# EAGLE design ESP8266-TFT-PCB (EAGLE 8.7.1)
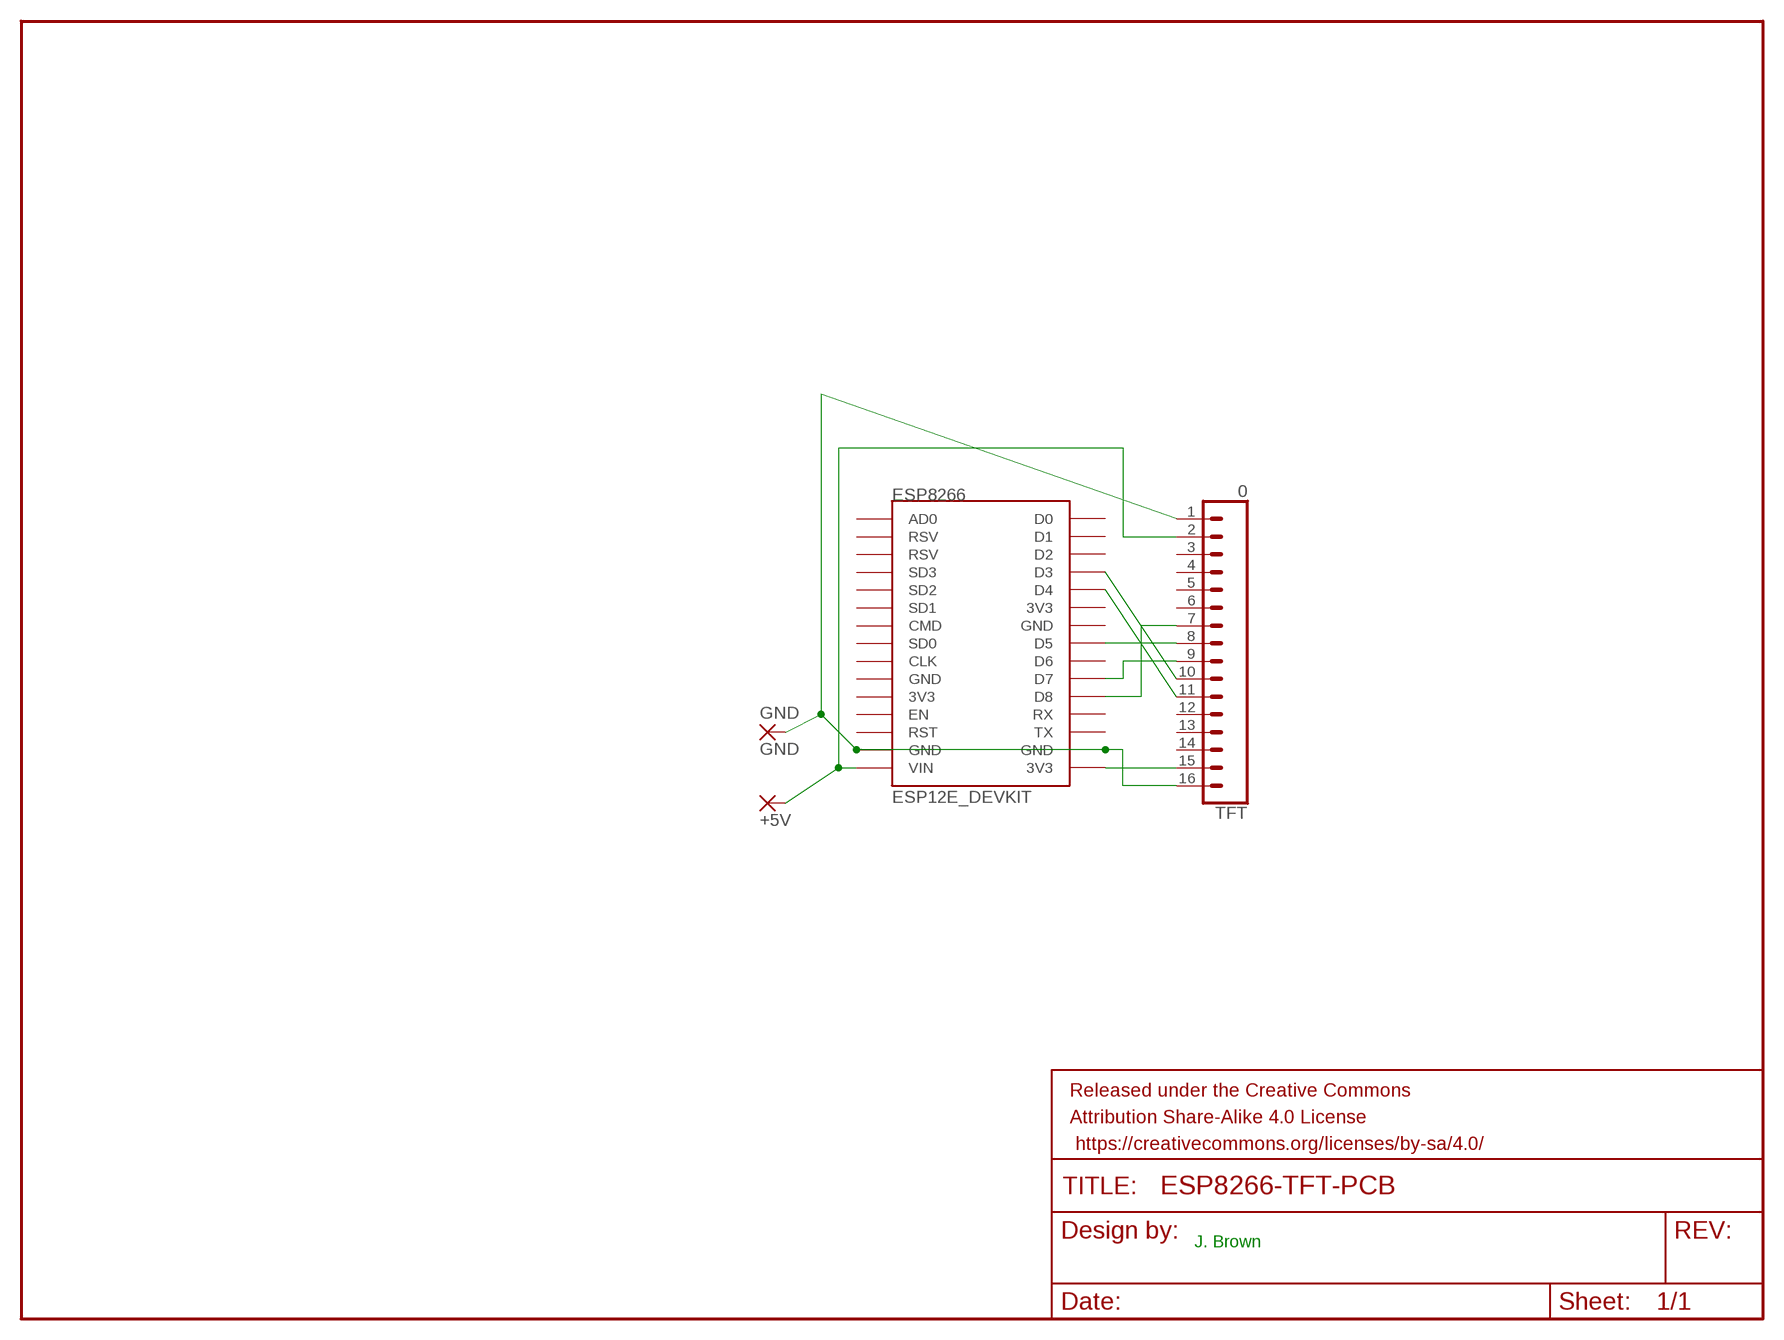
[diagram p0: schematic, sheet 1]

## Parts
ESP8266  ESP12E_DEVKIT  [ESP12E_DEVKIT]
FRAME1  FRAME-LETTER  [CREATIVE_COMMONS]
GND  GND  3,81/1,4  [3,81/1,4]
TFT  0  CONN_16  [1X16]
VCC  +5V  3,81/1,4  [3,81/1,4]

## Nets
GND: ESP8266.GND@1(GND) ESP8266.GND@3(GND) GND.1(P) TFT.1 TFT.16
N$1: ESP8266.3V3@2(3V3) TFT.15
N$5: ESP8266.D8 TFT.7
N$6: ESP8266.D5 TFT.8
N$7: ESP8266.D7 TFT.9
N$8: ESP8266.D4 TFT.11
N$9: ESP8266.D3 TFT.10
VCC: ESP8266.VIN TFT.2 VCC.1(P)
Unconnected: ESP8266.3V3@0(3V3) ESP8266.3V3@1(3V3) ESP8266.AD0 ESP8266.CLK ESP8266.CMD ESP8266.D0 ESP8266.D1 ESP8266.D2 ESP8266.D6 ESP8266.EN ESP8266.GND@0(GND) ESP8266.GND@2(GND) ESP8266.RST ESP8266.RSV@0(RSV) ESP8266.RSV@1(RSV) ESP8266.RX ESP8266.SD0 ESP8266.SD1 ESP8266.SD2 ESP8266.SD3 ESP8266.TX TFT.3 TFT.4 TFT.5 TFT.6 TFT.12 TFT.13 TFT.14

## Notes on the sheet
- J. Brown

## Library data of the parts
ESP8266 = ESP12E_DEVKIT:ESP12E_DEVKIT: ESP12E DEVKIT BOARD
FRAME1 = SparkFun-Aesthetics:FRAME-LETTER: Schematic Frame - Letter Standard 8.5x11 US Letter frame
GND VCC = wirepad:3,81/1,4: THROUGH-HOLE PAD
TFT = SparkFun-Connectors:CONN_16: Multi connection point. Often used as Generic Header-pin footprint for 0.1 inch spaced/style header connections On any of the 0.1 inch spaced packages, you can populate with these: Break Away Headers - Straight <https://www.sparkfun.com/products/116> (PRT-00116) Break Away Male Headers - Right Angle <https://www.sparkfun.com/products/553> (PRT-00553) Female Headers <https://www.sparkfun.com/products/115> (PRT-00115) Break Away Headers - Machine Pin <https://www.sparkfun.com/products/117> (PRT-00117) Break Away Female Headers - Swiss Machine Pin <https://www.sparkfun.com/products/743> (PRT-00743) For SCREWTERMINALS and SPRING TERMINALS visit here: Screw Terimnals on SparkFun.com <https://www.sparkfun.com/search/results?term=Screw+Terminals> (5mm/3.5mm/2.54mm spacing) This device is also useful as a general connection point to wire up your design to another part of your project. Our various solder wires solder well into these plated through hole pads. Hook-Up Wire - Assortment (Stranded, 22 AWG) <https://www.sparkfun.com/products/11375> (PRT-11375) Hook-Up Wire - Assortment (Solid Core, 22 AWG) <https://www.sparkfun.com/products/11367> (PRT-11367) View the entire wire category on our website here <https://www.sparkfun.com/categories/141> Special notes: Molex polarized connector foot print use with SKU : PRT-08231 with associated crimp pins and housings. 1MM SMD Version SKU: PRT-10208 NOTES ON THE VARIANTS LOCK and LOCK_LONGPADS... This footprint was designed to help hold the alignment of a through-hole component (i.e. 6-pin header) while soldering it into place. You may notice that each hole has been shifted either up or down by 0.005 of an inch from it's more standard position (which is a perfectly straight line). This slight alteration caused the pins (the squares in the middle) to touch the edges of the holes. Because they are alternating, it causes a "brace" to hold the component in place. 0.005 has proven to be the perfect amount of "off-center" position when using our standard breakaway headers. Although looks a little odd when you look at the bare footprint, once you have a header in there, the alteration is very hard to notice. Also,if you push a header all the way into place, it is covered up entirely on the bottom side.

## Board
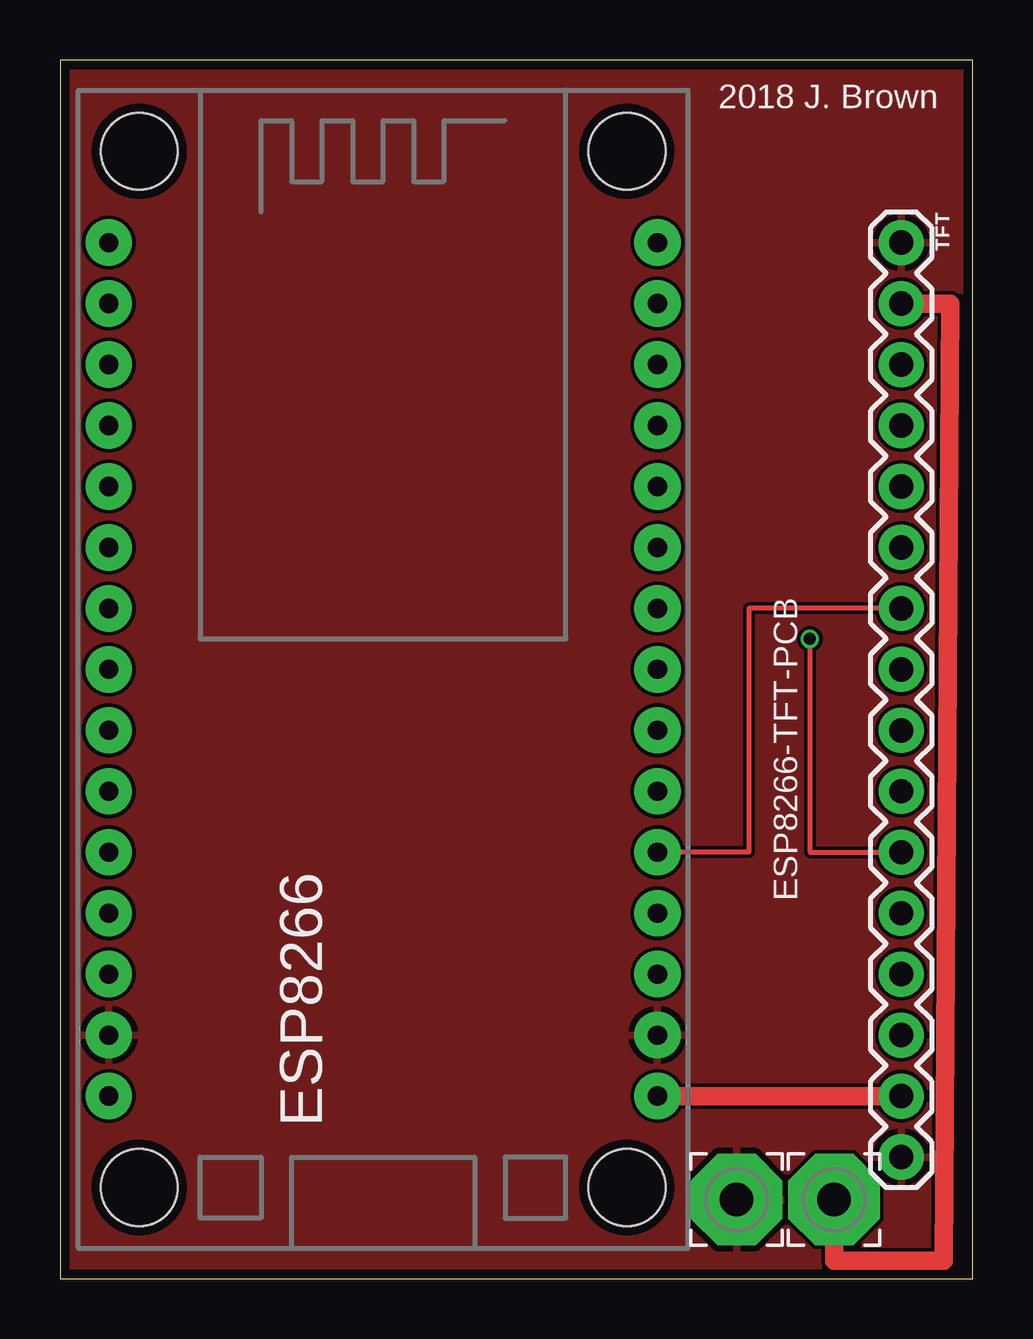
[diagram p1: board, top side]
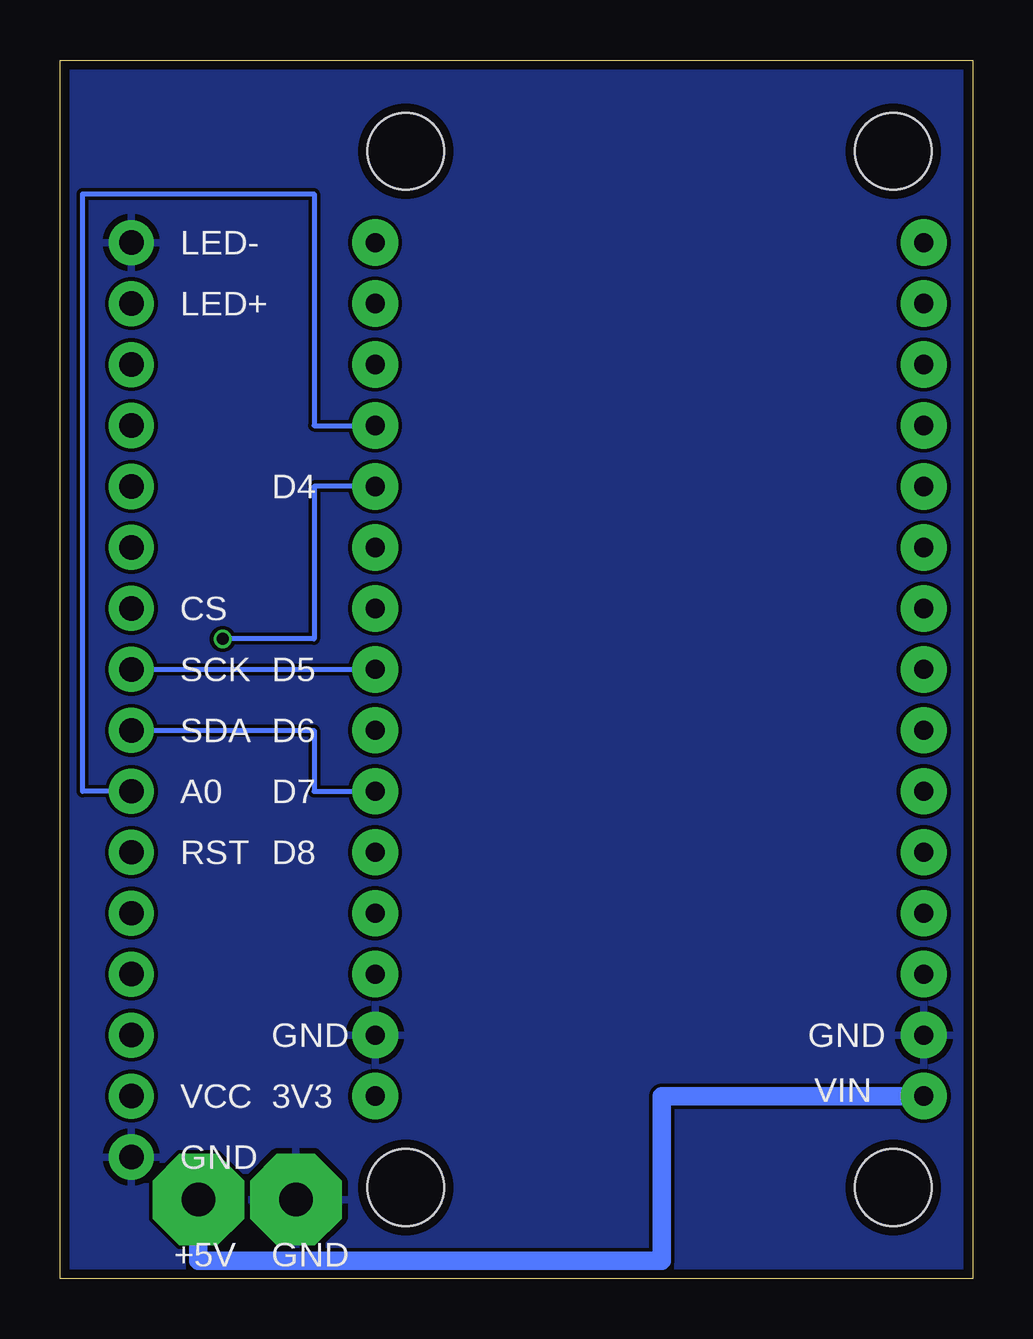
[diagram p2: board, bottom side, seen from below]

Size 38.02 x 50.79 mm. Coordinates in mm from the lower left corner, seen from the top.
Outline: 0,0 38.02,0 38.02,50.79 0,50.79 0,0
Copper layers (1*16): Top 0.035559375mm / dielectric 1.6mm / Bottom 0.035559375mm
Design rules "oshpark-2layer": minimum track width 6mil, minimum drill 10mil, track to track 6mil, track to pad 6mil, pad to pad 6mil, via to via 6mil, smd to smd 6mil, copper to edge 15mil, drill to drill 6mil, minimum pad ring 5mil, minimum via ring 5mil, stop-mask expansion 2.5mil, vias tented up to drill 0mil, thermal gap 10mil

### Footprints (pad centres in the part's own frame; a part is rotated, then mirrored left to right if it is on the bottom)
ESP12E_DEVKIT = drill 0.8 pad 1.93: 3V3@0 -11.43,-7.62; 3V3@1 11.43,5.08; 3V3@2 11.43,-17.78; AD0 -11.43,17.78; CLK -11.43,-2.54; CMD -11.43,2.54; D0 11.43,17.78; D1 11.43,15.24; D2 11.43,12.7; D3 11.43,10.16; D4 11.43,7.62; D5 11.43,0; D6 11.43,-2.54; D7 11.43,-5.08; D8 11.43,-7.62; EN -11.43,-10.16; GND@0 -11.43,-5.08; GND@1 -11.43,-15.24; GND@2 11.43,2.54; GND@3 11.43,-15.24; RST -11.43,-12.7; RSV@0 -11.43,15.24; RSV@1 -11.43,12.7; RX 11.43,-10.16; SD0 -11.43,0; SD1 -11.43,5.08; SD2 -11.43,7.62; SD3 -11.43,10.16; TX 11.43,-12.7; VIN -11.43,-17.78 | hole 3.2: -10.16,21.59; 10.16,21.59; 10.16,-21.59; -10.16,-21.59
3,81/1,4 = drill 1.397 pad 3.81 octagon: 1 0,0
1X16 = drill 1.016 pad 1.88: 1 0,0; 2 2.54,0; 3 5.08,0; 4 7.62,0; 5 10.16,0; 6 12.7,0; 7 15.24,0; 8 17.78,0; 9 20.32,0; 10 22.86,0; 11 25.4,0; 12 27.94,0; 13 30.48,0; 14 33.02,0; 15 35.56,0; 16 38.1,0

### Placement (x,y rotation side)
ESP8266  13.46,25.4 0 top
FRAME1  -29.72,-43.18 0 top  (outside the outline)
GND  28.19,3.3 0 top
TFT  35.05,43.18 270 top
VCC  32.26,3.3 0 top

### Tracks (layer width: path | path; a pad name or v marks a point on that pad's centre or on a via)
GND
  pour Bottom: 0,50.8 38.1,50.8 38.1,0 0,0
  pour Top: 0,50.8 38.1,50.8 38.1,0 0,0
N$1
  Top 0.762: TFT.15 ESP8266.3V3@2
N$5
  Top 0.203: TFT.7 28.7,27.94 28.7,17.78 ESP8266.D8
N$6
  Bottom 0.203: TFT.8 ESP8266.D5
N$7
  Bottom 0.203: TFT.9 27.43,22.86 27.43,20.32 ESP8266.D7
N$8  (via drill 0.51)
  Top 0.203: v31.24,26.67 31.24,17.78 TFT.11
  Bottom 0.203: ESP8266.D4 27.43,33.02 27.43,26.67 v31.24,26.67
N$9
  Bottom 0.203: TFT.10 37.08,20.32 37.08,45.21 27.43,45.21 27.43,35.56 ESP8266.D3
VCC
  Top 0.762: TFT.2 37.08,40.64 36.83,0.76 32.26,0.76 VCC.1
  Bottom 0.762: ESP8266.VIN 12.95,7.62 12.95,0.76 32.26,0.76 VCC.1

### Text on the board
tPlace: 2018 J. Brown | ESP8266-TFT-PCB
bPlace: LED- | LED+ | D4 | CS | D5 | SCK | D6 | SDA | D7 | A0 | D8 | RST | GND | GND | VIN | 3V3 | VCC | GND | GND | +5V